# EAGLE design UsbSwitch (EAGLE 6.5.0)
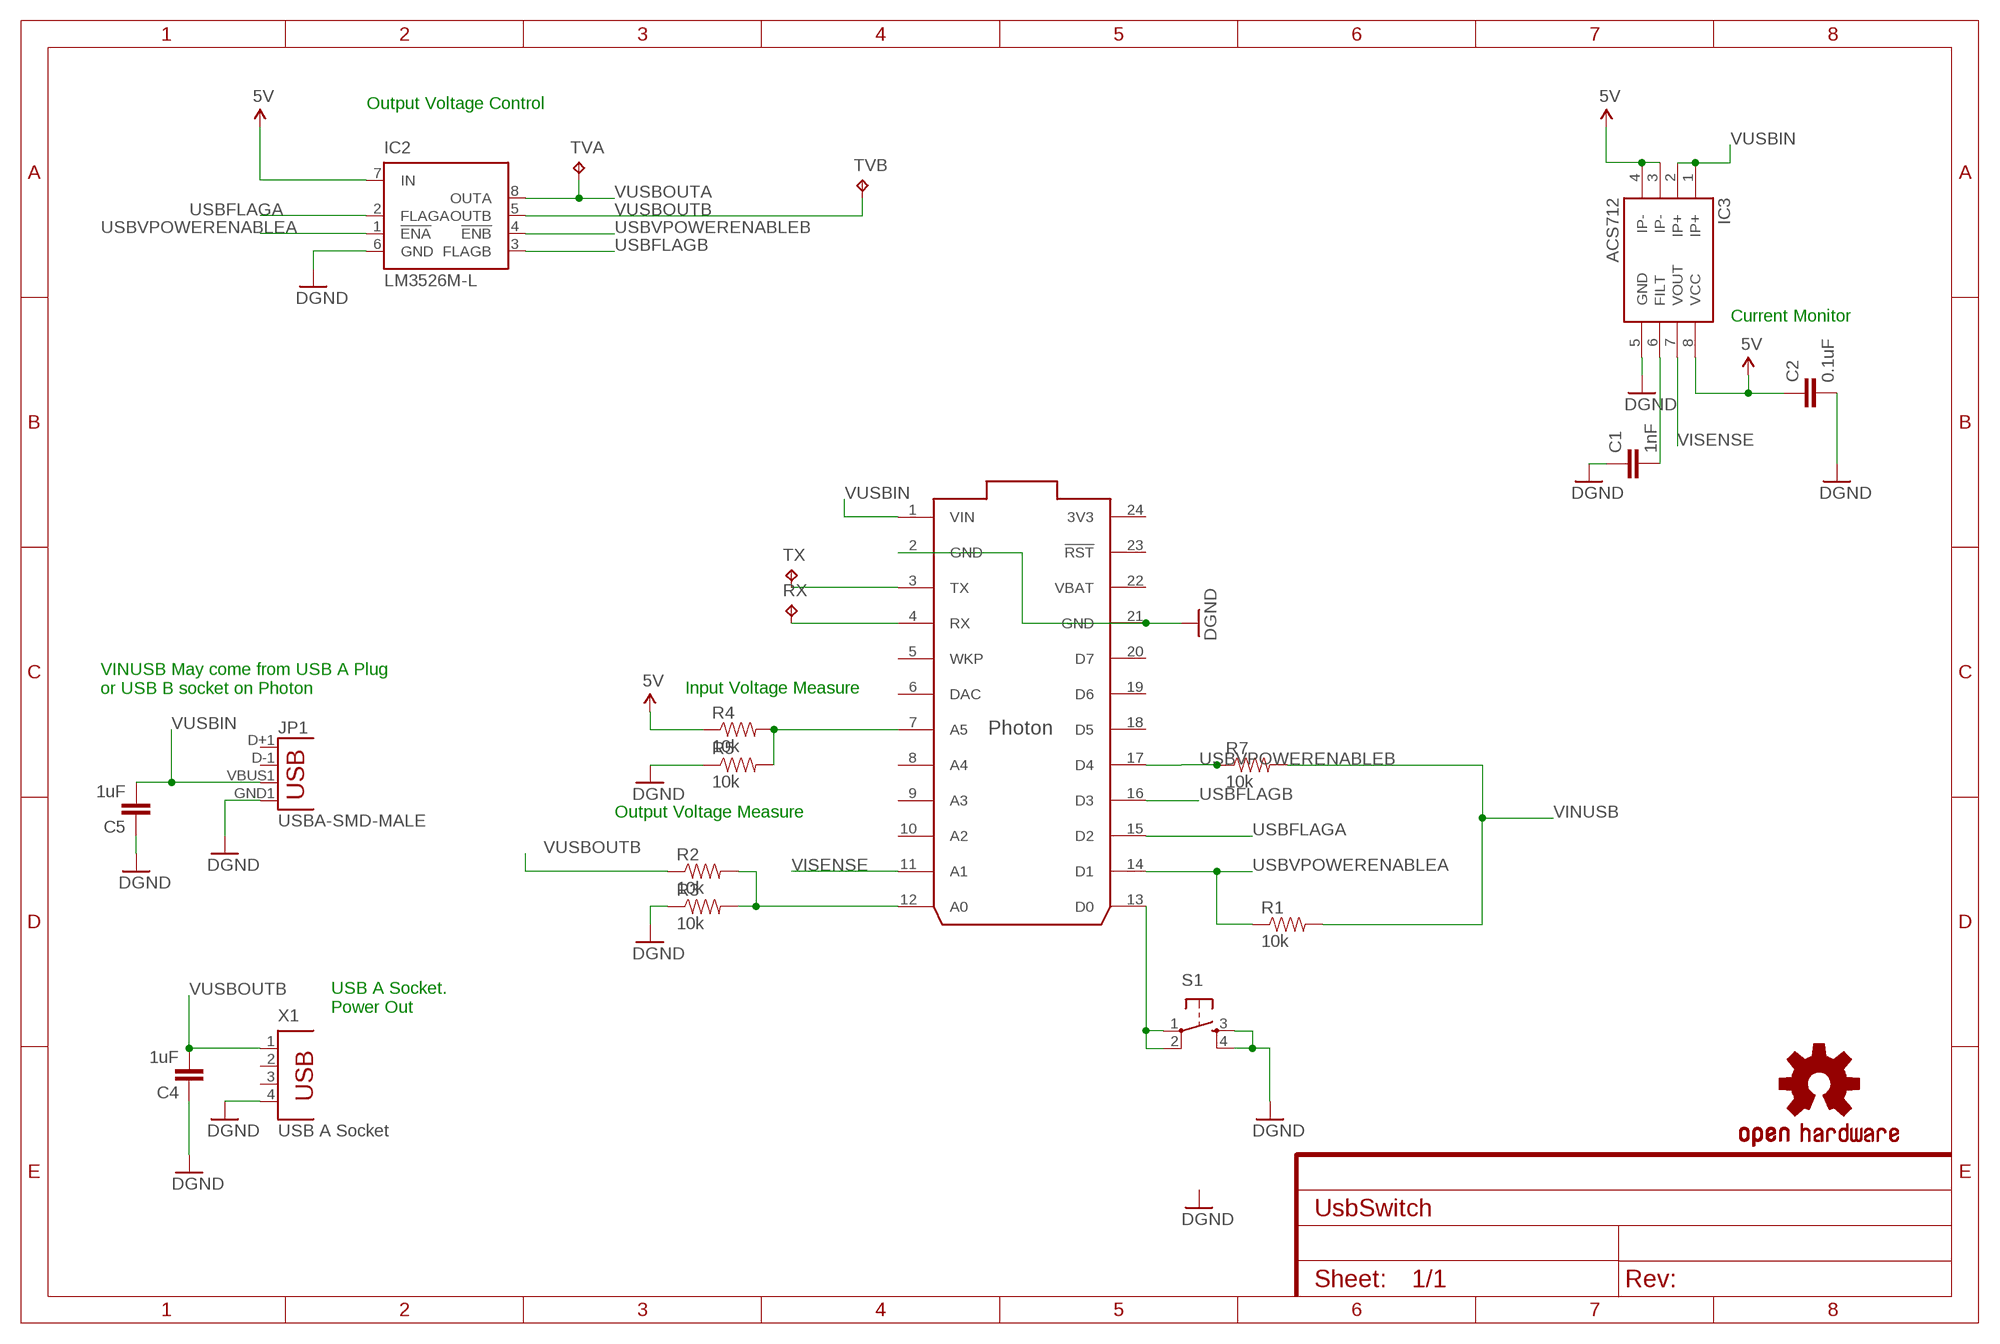
[diagram p0: schematic, sheet 1]

## Parts
C1  1nF  CAP0805  [0805]
C2  0.1uF  CAP0805  [0805]
C4  1uF  CAP0805  [0805]
C5  1uF  CAP0805  [0805]
IC1  PHOTON  PHOTON_WITH_HEADERS  [PHOTON]
IC2  LM3526M-L  [SO08]
IC3  ACS712  [SO08]
JP1  USBA-SMD-MALE  [USB-A-SMT-MALE]
LOGO1  OSHW-LOGOM-COPPER  [OSHW-LOGO-M_COPPER]
R1  10k  RESISTOR1206  [1206]
R2  10k  RESISTOR1206  [1206]
R3  10k  RESISTOR1206  [1206]
R4  10k  RESISTOR1206  [1206]
R5  10k  RESISTOR1206  [1206]
R7  10k  RESISTOR1206  [1206]
RX  TPTP20SQ  [TP20SQ]
S1  TAC_SWITCHSMD  [TACTILE_SWITCH_SMD]
TVA  TPTP20SQ  [TP20SQ]
TVB  TPTP20SQ  [TP20SQ]
TX  TPTP20SQ  [TP20SQ]
X1  USB A Socket  PN87520  [PN87520]

## Nets
5V: C2.1 IC2.7(IN) IC3.3(IP-) IC3.4(IP-) IC3.8(VCC) R4.1
GND: C1.1 C2.2 C4.1 C5.1 IC1.2(GND) IC1.21(GND) IC2.6(GND) IC3.5(GND) JP1.GND1(GND) R3.1 R5.1 S1.3 S1.4 X1.4 ; supply symbol labelled DGND
N$1: IC1.13(D0) S1.1 S1.2
N$3: C1.2 IC3.6(FILT)
N$6: IC1.3(TX) TX.TP
N$7: IC1.4(RX) RX.TP
N$21: IC1.12(A0) R2.2 R3.2
N$23: IC1.7(A5) R4.2 R5.2
USBFLAGA: IC1.15(D2) IC2.2(FLAGA)
USBFLAGB: IC1.16(D3) IC2.3(FLAGB)
USBVPOWERENABLEA: IC1.14(D1) IC2.1(!ENA) R1.1
USBVPOWERENABLEB: IC1.17(D4) IC2.4(!ENB) R7.1
VINUSB: R1.2 R7.2
VISENSE: IC1.11(A1) IC3.7(VOUT)
VUSBIN: C5.2 IC1.1(VIN) IC3.1(IP+) IC3.2(IP+) JP1.VBUS1(VBUS)
VUSBOUTA: IC2.8(OUTA) TVA.TP
VUSBOUTB: C4.2 IC2.5(OUTB) R2.1 TVB.TP X1.1
Unconnected: IC1.5(WKP) IC1.6(DAC) IC1.8(A4) IC1.9(A3) IC1.10(A2) IC1.18(D5) IC1.19(D6) IC1.20(D7) IC1.23(!RST) JP1.D+1(D+) JP1.D-1(D-) X1.2 X1.3

## Notes on the sheet
- Output Voltage Control
- Current Monitor
- VINUSB May come from USB A Plug 
  or USB B socket on Photon
- Input Voltage Measure
- Output Voltage Measure
- USB A Socket.
  Power Out

## Power pins joined to a net without a drawn wire
3V3: IC1.24(3V3)
VBAT: IC1.22(VBAT)

## Library data of the parts
C1 C2 C4 C5 = SparkFun-Passives:CAP: Capacitor Standard 0603 ceramic capacitor, and 0.1" leaded capacitor.
IC1 = Spark:PHOTON
IC2 = SH-linear:LM3526M-L: Dual Port USB Power Switch and Over-Current Protection LOW active
IC3 = SparkFun-AnalogIC:ACS712: Hall-effect-based isolated linear current sensor; PROD_ID: IC-08964
JP1 = SparkFun-Connectors:USB: USB Connectors USB-B-PTH is fully proven SKU : PRT-00139/CONN-08278 USB-miniB is fully proven SKU : PRT-00587 USB-A-PCB is untested. USB-A-H is throughly reviewed, but untested. Spark Fun Electronics SKU : PRT-00437 USB-B-SMT is throughly reviewed, but untested. Needs silkscreen touching up. USB-A-S has not been used/tested USB-MB-H has not been used/tested USB-MICROB has been used. CONN-09505
LOGO1 = SparkFun-Aesthetics:OSHW-LOGO: Open Source Hardware Logo This logo indicates the piece of hardware it is found on incorporates a OSHW license and/or adheres to the definition of open source hardware found here: http://freedomdefined.org/OSHW
R1-R5 R7 = SparkFun-Passives:RESISTOR: Resistor Basic schematic elements and footprints for 0603, 1206, and PTH resistors.
RX TVA TVB TX = testpad:TP: Test pad
S1 = Spark:TAC_SWITCH: SMD Tactiile Switch
X1 = con-berg:PN87520: BERG USB connector; OC_FARNELL: unknown; OC_NEWARK: unknown

## Board
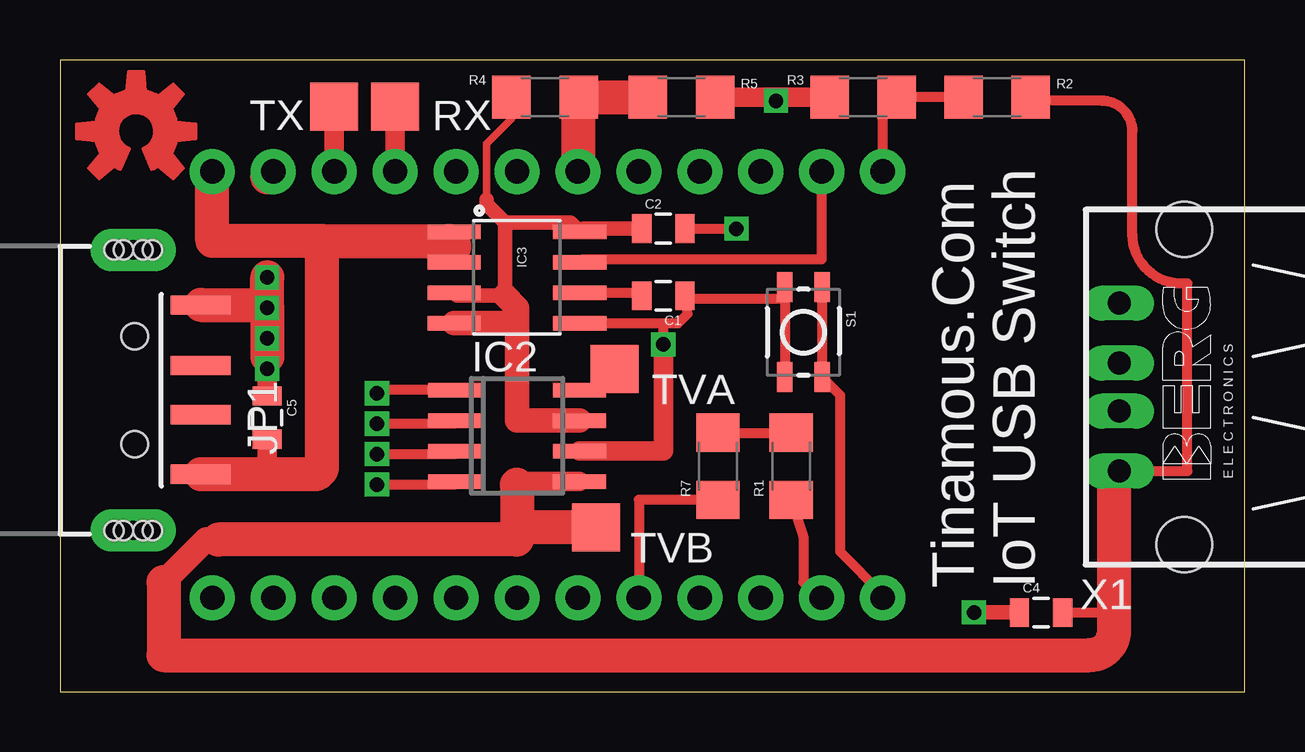
[diagram p1: board, top side]
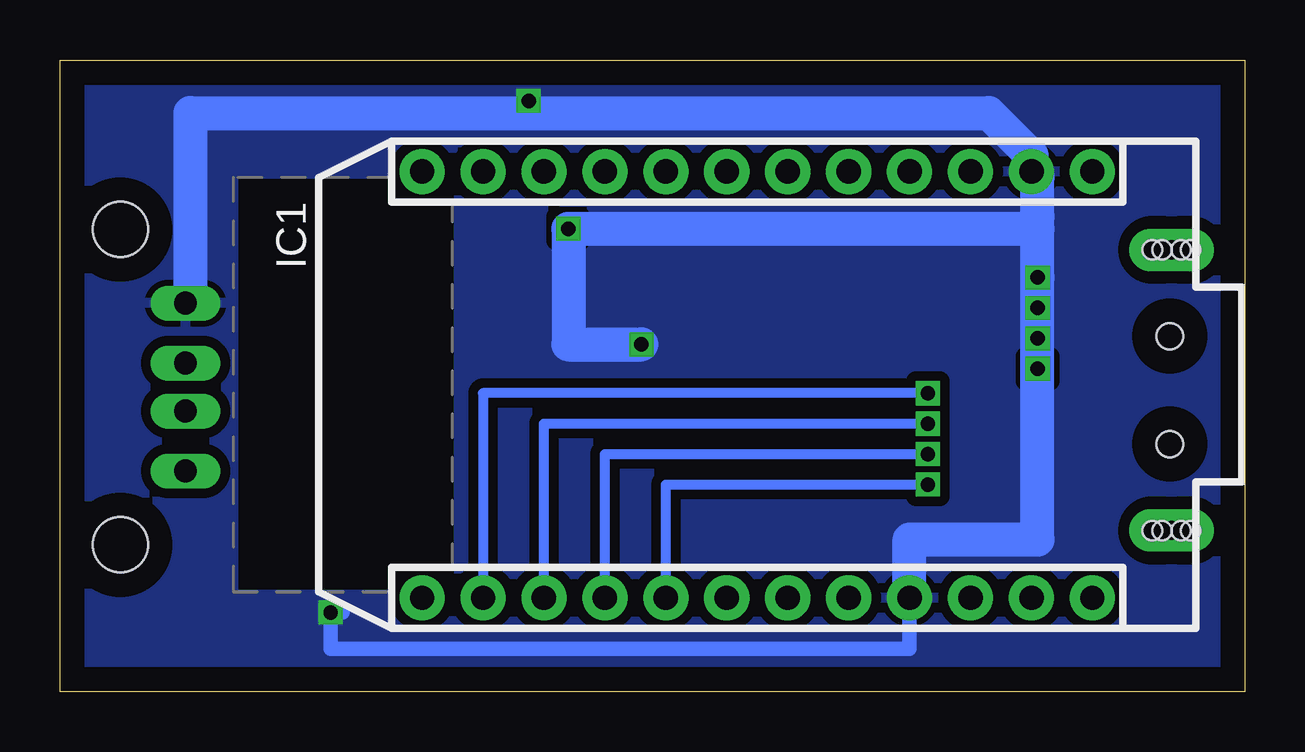
[diagram p2: board, bottom side, seen from below]

Size 49.38 x 26.34 mm. Coordinates in mm from the lower left corner, seen from the top.
Outline: 0,0 49.38,0 49.38,26.34 0,26.34 0,0
Copper layers (1*16): Top 0.035mm / dielectric 1.5mm / Bottom 0.035mm
Design rules "default": minimum track width 10mil, minimum drill 24mil, track to track 8mil, track to pad 8mil, pad to pad 8mil, via to via 8mil, smd to smd 8mil, copper to edge 40mil, drill to drill 8mil, minimum pad ring 10mil, minimum via ring 8mil, stop-mask expansion 4mil, vias tented up to drill 0mil, thermal gap 10mil

### Footprints (pad centres in the part's own frame; a part is rotated, then mirrored left to right if it is on the bottom)
0805 = smd 0.8 x 1.2: 1 -0.9,0; 2 0.9,0
PHOTON = drill 1.016 pad 1.88: 1 1.27,32.258; 2 1.27,29.718; 3 1.27,27.178; 4 1.27,24.638; 5 1.27,22.098; 6 1.27,19.558; 7 1.27,17.018; 8 1.27,14.478; 9 1.27,11.938; 10 1.27,9.398; 11 1.27,6.858; 12 1.27,4.318; 13 19.05,4.318; 14 19.05,6.858; 15 19.05,9.398; 16 19.05,11.938; 17 19.05,14.478; 18 19.05,17.018; 19 19.05,19.558; 20 19.05,22.098; 21 19.05,24.638; 22 19.05,27.178; 23 19.05,29.718; 24 19.05,32.258
SO08 = smd 0.6 x 2.2: 1 -1.905,-2.6; 2 -0.635,-2.6; 3 0.635,-2.6; 4 1.905,-2.6; 5 1.905,2.6; 6 0.635,2.6; 7 -0.635,2.6; 8 -1.905,2.6
SO08' = smd 0.61 x 2.21: 1 -1.905,-2.616; 2 -0.635,-2.616; 3 0.635,-2.616; 4 1.905,-2.616; 5 1.905,2.616; 6 0.635,2.616; 7 -0.635,2.616; 8 -1.905,2.616
USB-A-SMT-MALE = smd 0.8 x 2.5: D+1 1.027,-5.87; D-1 -1.027,-5.87; GND1 3.551,-5.87; VBUS1 -3.5,-5.87 | drill 0.8 pad 1.778 long: P$1 5.85,-3.05; P$3 -5.85,-3.05 | hole 1.1: 2.25,-3.12; -2.25,-3.12 | hole 0.8: -5.85,-3.45; -5.85,-3.85; -5.85,-2.65; -5.85,-2.25; 5.85,-3.45; 5.85,-3.85; 5.85,-2.65; 5.85,-2.25
1206 = smd 1.6 x 1.8: 1 -1.4,0; 2 1.4,0
TP20SQ = smd 2 x 2: TP 0,0
TACTILE_SWITCH_SMD = smd 1.25 x 0.65: 1 -1.875,0.775; 2 1.875,0.775; 3 -1.875,-0.775; 4 1.875,-0.775
PN87520 = drill 0.95 long: 1 -3.5,2.71; 2 -1,2.71; 3 1,2.71; 4 3.5,2.71 | hole 2.3: -6.57,0; 6.57,0

### Placement (x,y rotation side)
C1  25.15,16.51 180 top
C2  25.15,19.3 0 top
C4  40.89,3.3 0 top
C5  8.64,11.43 270 top
IC1  38.61,22.96 270 bottom
IC2  19.05,10.67 270 top
IC3  ACS712  [SO08']  19.05,17.27 270 top
JP1  0,12.57 90 top
LOGO1  3.17,23.37 0 top
R1  30.48,9.4 90 top
R2  39.07,24.79 180 top
R3  33.48,24.79 0 top
R4  20.22,24.79 0 top
R5  25.91,24.79 180 top
R7  27.43,9.4 90 top
RX  13.97,24.38 0 top
S1  30.99,14.99 270 top
TVA  23.11,13.46 0 top
TVB  22.35,6.86 0 top
TX  11.43,24.38 0 top
X1  46.86,12.7 90 top

### Tracks (layer width: path | path; a pad name or v marks a point on that pad's centre or on a via)
5V
  Top 0.305: 17.78,20.52 17.78,22.86 18.82,23.9 R4.1
  Top 0.61: IC3.3 16.56,16.51 18.54,16.51 18.54,19.56 | 18.54,19.56 17.78,20.32 17.78,20.52 | 18.54,19.56 21.29,19.56 IC3.8 21.79,19.3 C2.1
  Top 1.016: 18.54,16.51 19.05,16 19.05,15.37 | 19.05,15.37 19.05,11.3 IC2.7 | IC3.4 19.05,15.37
GND  (via drill 0.6)
  Top 0.406: IC3.5 25.15,15.37 | 25.15,15.37 25.78,15.37 26.16,15.75 26.16,16.39 | 26.16,16.39 C1.1 | v25.15,14.48 25.15,15.37 | 26.16,16.39 30.21,16.39 S1.3 S1.4 | C2.2 v28.19,19.3
  Top 0.61: C4.1 v38.1,3.3
  Top 0.813: IC2.6 25.15,10.03 v25.15,14.48 | C5.1 v8.64,14.73 | R3.1 R5.1 29.84,24.79 v29.84,24.64
  Top 1.422: JP1.GND1 8.51,16.12 arc-90 v8.64,16 | v8.64,16 v8.64,14.73 8.64,13.97 | 8.64,21.44 arc-90 IC1.2 | v8.64,16 v8.64,17.27
  Bottom 0.406: 8.64,19.3 8.64,19.81
  Bottom 0.61: 37.59,3.3 v38.1,3.3 38.1,1.78 13.97,1.78 13.97,3.81
  Bottom 0.813: v29.84,24.64 29.84,24.13
  Bottom 1.422: X1.4 43.94,16.41 43.94,24.13 29.84,24.13 10.67,24.13 8.89,22.35 IC1.2 arc90 8.64,21.44 8.64,19.81 v8.64,17.27 8.64,6.35 13.97,6.35 IC1.21 13.97,3.81 | v25.15,14.48 28.19,14.48 v28.19,19.3 8.64,19.3
  pour Bottom (isolate 0.406): 0,26.42 32.77,26.42 32.77,0 0,0
  pour Bottom (isolate 0.406): 49.53,26.16 33.02,26.16 33.02,20.57 35.56,20.57 35.56,21.59 42.16,21.59 42.16,4.06 35.56,4.06 35.56,5.08 32.77,5.08 32.77,0 49.53,0
N$1
  Top 0.406: S1.1 S1.2 32.51,12.36 32.51,5.84 34.29,4.06 IC1.13
N$3
  Top 0.406: 24.38,16.51 C1.2 24.12,16.64 IC3.6
N$6
  Top 0.813: IC1.3 TX.TP
N$7
  Top 0.813: IC1.4 RX.TP
N$8  (via drill 0.6)
  other vias: 8.64,13.46
N$10  (via drill 0.6)
  other vias: 28.19,19.3
N$21
  Top 0.406: R2.2 R3.2 34.29,24.3 IC1.12
N$23
  Top 0.305: IC1.7 21.62,21.72
  Top 1.422: 21.62,21.72 R4.2 R5.2
USBFLAGA  (via drill 0.6)
  Top 0.406: v13.21,11.18 16.45,11.18 IC2.2
  Bottom 0.406: IC1.15 29.21,11.18 v13.21,11.18
USBFLAGB  (via drill 0.6)
  Top 0.406: v13.21,9.91 16.45,9.91 IC2.3
  Bottom 0.406: IC1.16 26.67,9.91 v13.21,9.91
USBVPOWERENABLEA  (via drill 0.6)
  Top 0.406: R1.1 30.99,6.47 30.99,4.57 31.65,3.91 IC1.14 | IC2.1 13.21,12.57 v13.21,12.45
  Bottom 0.406: v13.21,12.45 31.75,12.45 IC1.14
USBVPOWERENABLEB  (via drill 0.6)
  Top 0.406: v13.21,8.64 16.45,8.64 IC2.4 | R7.1 24.13,8 IC1.17
  Bottom 0.406: IC1.17 24.13,8.64 v13.21,8.64
VINUSB
  Top 0.406: R7.2 R1.2
VISENSE
  Top 0.406: IC3.7 21.79,18.03 31.75,18.03 IC1.11
VUSBIN
  Top 0.61: IC3.1 16.43,18.54 IC3.2
  Top 0.813: C5.2 8.64,9.07
  Top 1.422: JP1.VBUS1 8.64,9.07 10.6,9.07 arc90 10.92,9.4 10.92,18.8 | 10.92,18.8 16.18,18.8 arc-90 16.43,18.54 | 10.92,18.8 6.35,18.8 IC1.1
VUSBOUTA
  Top 0.406: IC2.8 22.23,12.57 arc90 TVA.TP
VUSBOUTB
  Top 0.406: C4.2 43.94,3.3 43.94,3.05 | X1.1 46.99,9.2 46.99,17.02 46.74,17.02 arc-90 44.7,19.05 44.7,23.37 arc90 43.43,24.64 40.62,24.64 arc90 R2.1
  Top 0.813: IC2.5 19.05,8.76 19.05,8.64
  Top 1.016: 6.6,6.35 6.1,6.35 4.32,4.57
  Top 1.422: 19.05,8.64 19.05,6.86 | 19.05,6.86 19.05,6.35 6.6,6.35 | 4.32,4.57 4.32,1.52 42.93,1.52 arc90 43.94,2.54 43.94,3.05 43.94,8.99 arc-90 X1.1 | TVB.TP 19.05,6.86

### Text on the board
tNames: Tinamous.Com | IoT USB Switch